# Altium schematic sheet pca20053_sheet4_power_supply.SchDoc: Thingy:53 Power Supply
size A3; Organization: Nordic Semiconductor; DocumentNumber: 4; SheetNumber: 4; SheetTotal: 6; CompanyName: Nordic Semiconductor; DocumentSize: A3
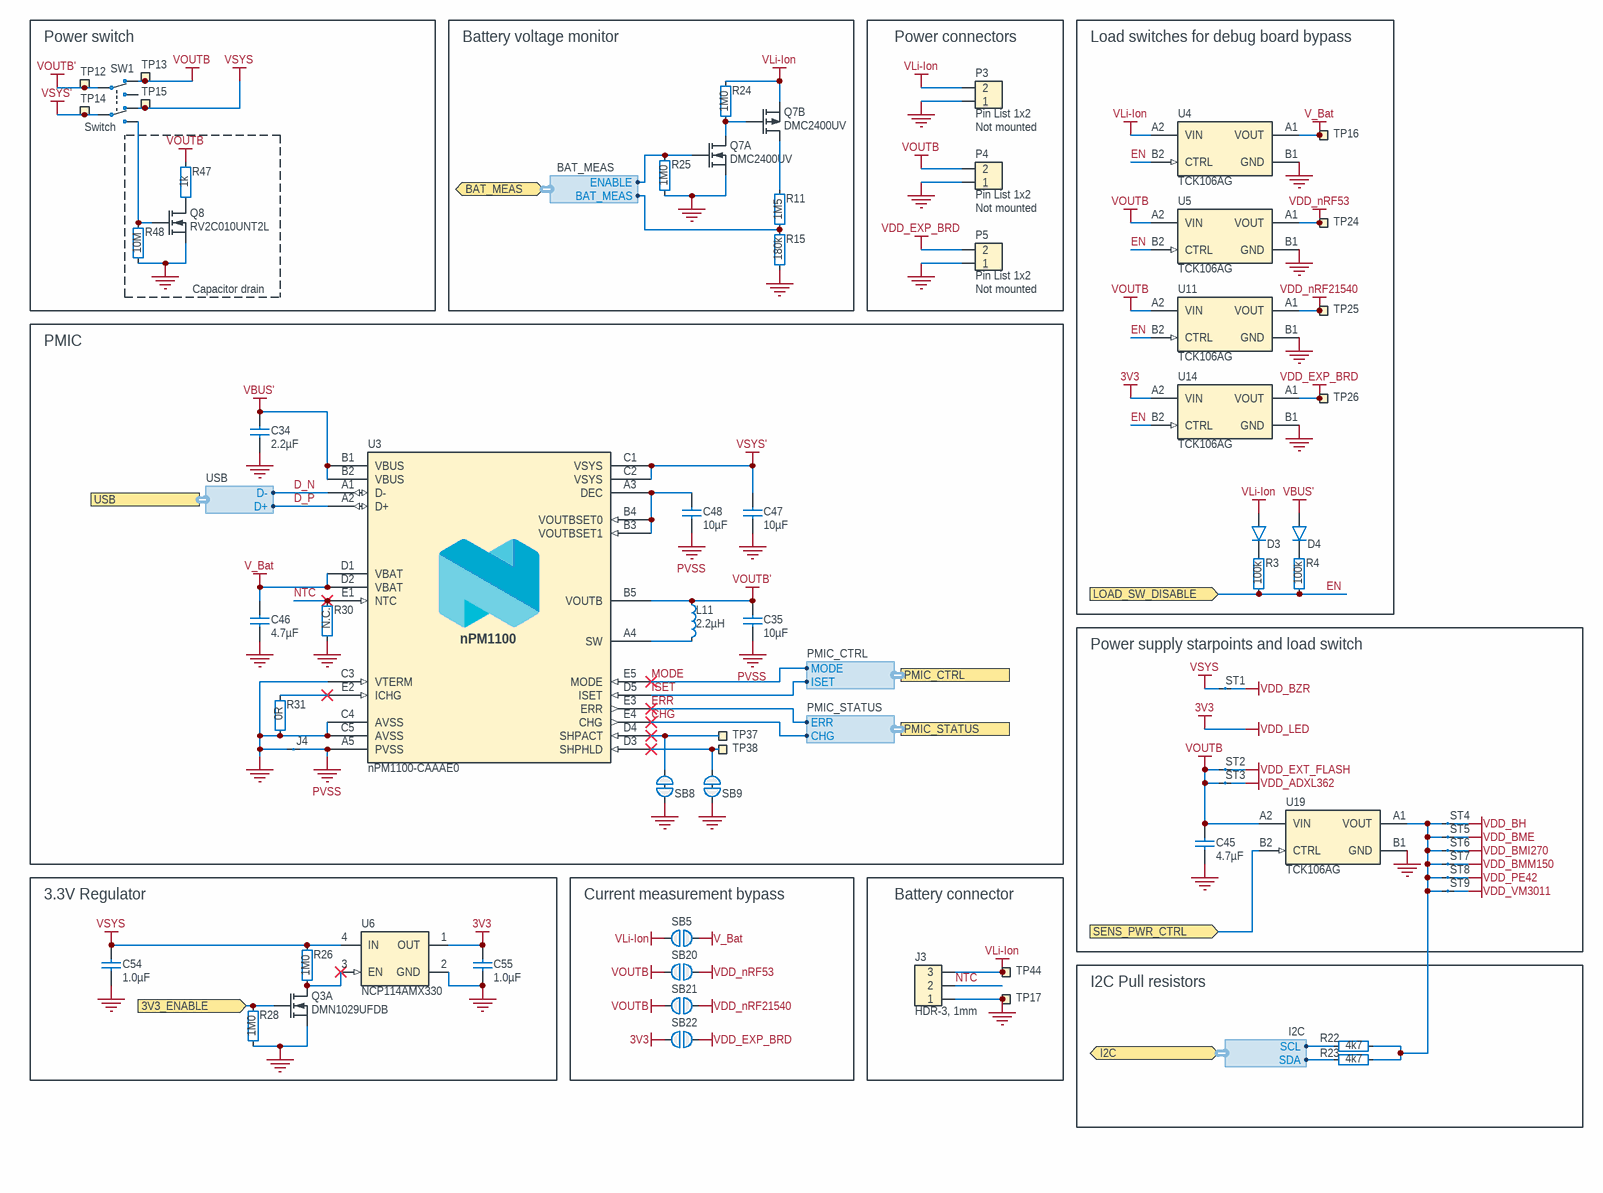
[diagram p0: pca20053_sheet4_power_supply.SchDoc]

## Parts
C34  2.2µF  [CAPC1608X06L]
C35  10µF  [CAPC1608X06L]
C45  4.7µF  [CAPC1608X06L]
C46  4.7µF  [CAPC1608X06L]
C47  10µF  [CAPC1608X06L]
C48  10µF  [CAPC1608X06L]
C54  1.0µF  [CAPC1005X04L]
C55  1.0µF  [CAPC1005X04L]
D3  BAS716  [SOD-523]  (value not drawn)
D4  BAS716  [SOD-523]  (value not drawn)
J3  HDR-3, 1mm  [SM03B-SRSS-TB]
J4  Net tie  [2 PIN STARPOINT]  (value not drawn)  (net tie, no BOM)
L11  2.2µH  [INDC1608X06L]
P3  Pin List 1x2  Assembly: Not mounted  [LIST_1x2-NC]
P4  Pin List 1x2  Assembly: Not mounted  [LIST_1x2-NC]
P5  Pin List 1x2  Assembly: Not mounted  [LIST_1x2-NC]
Q3  DMN1029UFDB  [DFN65P200X60_HS-6N]  (part A of 2)
Q7  DMC2400UV  [SOTFL50P162X60-6N]  (parts A,B of 2)
Q8  RV2C010UNT2L  [DFN65P100X40-3L]
R3  100k  [RESC0603X03L_C]
R4  100k  [RESC0603X03L_C]
R11  1M5  [RESC0603X03L_C]
R15  180k  [RESC0603X03L_C]
R22  4k7  [RESC0603X03L_C]
R23  4k7  [RESC0603X03L_C]
R24  1M0  [RESC0603X03L_C]
R25  1M0  [RESC0603X03L_C]
R26  1M0  [RESC0603X03L_C]
R28  1M0  [RESC0603X03L_C]
R30  N.C.  [RESC0603X03L_C_NC]
R31  0R  [RESC0603X03L_C]
R47  1k  [RESC0603X03L_C]
R48  10M  [RESC0603X03L_C]
SB5  Solderbridge  [Solderbridge]  (value not drawn)  (no BOM)
SB8  Solderbridge  [Solderbridge_Shorted]  (value not drawn)  (net tie, no BOM)
SB9  Solderbridge  [Solderbridge_Shorted]  (value not drawn)  (net tie, no BOM)
SB20  Solderbridge  [Solderbridge]  (value not drawn)  (no BOM)
SB21  Solderbridge  [Solderbridge]  (value not drawn)  (no BOM)
SB22  Solderbridge  [Solderbridge]  (value not drawn)  (no BOM)
ST1  Net tie  [2 PIN STARPOINT]  (value not drawn)  (net tie, no BOM)
ST2  Net tie  [2 PIN STARPOINT]  (value not drawn)  (net tie, no BOM)
ST3  Net tie  [2 PIN STARPOINT]  (value not drawn)  (net tie, no BOM)
ST4  Net tie  [2 PIN STARPOINT]  (value not drawn)  (net tie, no BOM)
ST5  Net tie  [2 PIN STARPOINT]  (value not drawn)  (net tie, no BOM)
ST6  Net tie  [2 PIN STARPOINT]  (value not drawn)  (net tie, no BOM)
ST7  Net tie  [2 PIN STARPOINT]  (value not drawn)  (net tie, no BOM)
ST8  Net tie  [2 PIN STARPOINT]  (value not drawn)  (net tie, no BOM)
ST9  Net tie  [2 PIN STARPOINT]  (value not drawn)  (net tie, no BOM)
SW1  Switch  [Switch-Slide-RA-J-Lead-DPDT-8.5x3.5mm]
TP12  Ø1.5mm,SMD  [TP_SMD_D1.5mm]  (value not drawn)  (no BOM)
TP13  Ø1.5mm,SMD  [TP_SMD_D1.5mm]  (value not drawn)  (no BOM)
TP14  Ø1.5mm,SMD  [TP_SMD_D1.5mm]  (value not drawn)  (no BOM)
TP15  Ø1.5mm,SMD  [TP_SMD_D1.5mm]  (value not drawn)  (no BOM)
TP16  Ø1.5mm,SMD  [TP_SMD_D1.5mm]  (value not drawn)  (no BOM)
TP17  Ø1.5mm,SMD  [TP_SMD_D1.5mm]  (value not drawn)  (no BOM)
TP24  Ø1.5mm,SMD  [TP_SMD_D1.5mm]  (value not drawn)  (no BOM)
TP25  Ø1.5mm,SMD  [TP_SMD_D1.5mm]  (value not drawn)  (no BOM)
TP26  Ø1.5mm,SMD  [TP_SMD_D1.5mm]  (value not drawn)  (no BOM)
TP37  Ø1.5mm,SMD  [TP_SMD_D1.5mm]  (value not drawn)  (no BOM)
TP38  Ø1.5mm,SMD  [TP_SMD_D1.5mm]  (value not drawn)  (no BOM)
TP44  Ø1.5mm,SMD  [TP_SMD_D1.5mm]  (value not drawn)  (no BOM)
U3  nPM1100-CAAAE0  [BGA25C40P5X5_200X200X50]
U4  TCK106AG  [BGA4C40P2X2_76X76X62]
U5  TCK106AG  [BGA4C40P2X2_76X76X62]
U6  NCP114AMX330  [UDFN65P100X100X60_HS-5N]
U11  TCK106AG  [BGA4C40P2X2_76X76X62]
U14  TCK106AG  [BGA4C40P2X2_76X76X62]
U19  TCK106AG  [BGA4C40P2X2_76X76X62]

## Blocks framed on the sheet
Power switch: SW1 TP12-TP15
Battery voltage monitor: Q7 R11 R15 R24 R25
Power connectors: P3-P5
Load switches for debug board bypass: D3 D4 R3 R4 TP16 TP24-TP26 U4 U5 U11 U14
Capacitor drain: Q8 R47 R48
PMIC: C34 C35 C46-C48 J4 L11 R30 R31 SB8 SB9 TP37 TP38 U3
Power supply starpoints and load switch: C45 ST1-ST9 U19
3.3V Regulator: C54 C55 Q3 R26 R28 U6
Current measurement bypass: SB5 SB20-SB22
Battery connector: J3 TP17 TP44
I2C Pull resistors: R22 R23

## Ports
3V3_ENABLE (in), BAT_MEAS (bidir, harness BAT_MEAS), I2C (bidir, harness I2C), LOAD_SW_DISABLE (in), PMIC_CTRL (harness PMIC_CTRL), PMIC_STATUS (harness PMIC_STATUS), SENS_PWR_CTRL (in), USB (harness USB)

## Harnesses
USB: D+, D-
PMIC_CTRL: ISET, MODE
PMIC_STATUS: ERR, CHG
BAT_MEAS: BAT_MEAS, ENABLE
I2C: SDA, SCL

## Nets
3V3: C55.1 SB22.2 U6.1(OUT) U14.A2(VIN)  [also labelled VDD_LED]
GND: C34.1 C45.1 C46.1 C47.1 C54.2 C55.2 J3.1 J4.1 P3.1 P4.1 P5.1 Q3.1(S1) Q7.1(S1) Q8.2(S) R15.1 R25.1 R28.1 R30.1 R31.1 R48.2 SB8.2 SB9.2 TP17.1 U3.C3(VTERM) U3.C4(AVSS) U3.C5(AVSS) U4.B1(GND) U5.B1(GND) U6.2(GND) U6.5(EPAD) U11.B1(GND) U14.B1(GND) U19.B1(GND)
PVSS: C35.1 C48.1 J4.2 U3.A5(PVSS)
V_Bat: C46.2 SB5.1 TP16.1 U3.D1(VBAT) U3.D2(VBAT) U4.A1(VOUT)
VBUS': C34.2 D4.1(A) U3.B1(VBUS) U3.B2(VBUS)
VDD_ADXL362: ST3.2
VDD_BH: ST4.2
VDD_BME: ST5.2
VDD_BMI270: ST6.2
VDD_BMM150: ST7.2
VDD_BZR: ST1.2
VDD_EXP_BRD: P5.2 SB22.1 TP26.1 U14.A1(VOUT)
VDD_EXT_FLASH: ST2.2
VDD_nRF53: SB20.1 TP24.1 U5.A1(VOUT)
VDD_nRF21540: SB21.1 TP25.1 U11.A1(VOUT)
VDD_PE42: ST8.2
VDD_VM3011: ST9.2
VLi-Ion: D3.1(A) J3.3 P3.2 Q7.4(S2) R24.1 SB5.2 TP44.1 U4.A2(VIN)
VOUTB: C45.2 P4.2 R47.1 SB20.2 SB21.2 ST2.1 ST3.1 SW1.3(N.C-1) TP13.1 U5.A2(VIN) U11.A2(VIN) U19.A2(VIN)
VOUTB': C35.2 L11.1 SW1.2(COM-1) TP12.1 U3.B5(VOUTB)
VSYS: C54.1 R26.2 ST1.1 SW1.6(N.C-2) TP15.1 U6.4(IN)
VSYS': C47.2 SW1.5(COM-2) TP14.1 U3.C1(VSYS) U3.C2(VSYS)
3V3_ENABLE: Q3.2(G1) R28.2 ; port 3V3_ENABLE
CHG: U3.E4(CHG) ; port PMIC_STATUS.CHG
D_N: U3.A1(D-) ; port USB.D-
D_P: U3.A2(D+) ; port USB.D+
EN: R3.1 R4.1 U4.B2(CTRL) U5.B2(CTRL) U11.B2(CTRL) U14.B2(CTRL) ; port LOAD_SW_DISABLE
ERR: U3.E3(ERR) ; port PMIC_STATUS.ERR
ISET: U3.D5(ISET) ; port PMIC_CTRL.ISET
MODE: U3.E5(MODE) ; port PMIC_CTRL.MODE
NTC: J3.2 R30.2 U3.E1(NTC)
SENS_PWR_CTRL: U19.B2(CTRL) ; port SENS_PWR_CTRL
NetC48_2: C48.2 U3.A3(DEC) U3.B3(VOUTBSET1) U3.B4(VOUTBSET0)
NetD3_3: D3.3(C) R3.2
NetD4_3: D4.3(C) R4.2
NetL11_2: L11.2 U3.A4(SW)
NetQ3_6: Q3.6(D1) R26.1 U6.3(EN)
NetQ7_2: Q7.2(G1) R25.2 ; port BAT_MEAS.ENABLE
NetQ7_3: Q7.3(D2) R11.2
NetQ7_5: Q7.5(G2) Q7.6(D1) R24.2
NetQ8_1: Q8.1(G) R48.1 SW1.4(N.O-2)
NetQ8_3: Q8.3(D) R47.2
NetR11_1: R11.1 R15.2 ; port BAT_MEAS.BAT_MEAS
NetR22_1: R22.1 R23.1 ST4.1 ST5.1 ST6.1 ST7.1 ST8.1 ST9.1 U19.A1(VOUT)
NetR22_2: R22.2 ; port I2C.SCL
NetR23_2: R23.2 ; port I2C.SDA
NetR31_2: R31.2 U3.E2(ICHG)
NetSB8_1: SB8.1 TP37.1 U3.D4(SHPACT)
NetSB9_1: SB9.1 TP38.1 U3.D3(SHPHLD)

Not connected (* = marked no-connect by the designer): SW1 1(N.O-1)

## Notes on the sheet
- Title
- Size
- Date:
- File:
- A3
- PCB Assembly Number
- Sheet         of
- Drawn By:
- Revision
- Classification:
- (in symbol nPM1100-CAAAE0) nPM1100

## Library data of the parts
C34 = C0603-2µ2-25V-X5R-GRM188R61E225KA12D: Capacitor, Ceramic, X5R, ±10%, 25V; Manufacturer: Murata; Part number NEMS: 100200454; Artikkelnr Noca: N.A.; Pad Count: 2; Component Status: Active; Part Number: C0603-2µ2-25V-X5R-GRM188R61E225KA12D; Manufacturer Part Number: GRM188R61E225KA12D; ComponentLink1URL: https://search.murata.co.jp/Ceramy/image/img/A01X/G101/ENG/GRM188R61E225KA12-01.pdf; ComponentLink1Description: Datasheet; ComponentLink2URL: https://www.murata.com/en-global/products/productdetail?partno=GRM188R61E225KA12%23; ComponentLink2Description: Supplier link; HelpURL: N.A.; Footprint Doc: 0603; LatestRevisionDate: 2021-07-22; Published: 2020-12-16; Value: 2.2µF; Note: 25V; Supplier 1: Digi-Key; Supplier Part Number 1: 490-10731-1-ND; Supplier 2: Mouser; Supplier Part Number 2: 81-GRM188R61E225KA2D; Part number IPS: N.A.; Component Class: Capacitors; PartId: 100200454; Author: rsk; Part number Norautron: N.A.
C35 C47 C48 = C0603-10µ-25V-X5R-GRM188R61E106MA73J: Capacitor, Ceramic, X5R, ±20%, 25V; Manufacturer: Murata; Part number NEMS: 100200456; Artikkelnr Noca: N.A.; Pad Count: 2; Component Status: Active; Part Number: C0603-10µ-25V-X5R-GRM188R61E106MA73J; Manufacturer Part Number: GRM188R61E106MA73J; ComponentLink1URL: https://search.murata.co.jp/Ceramy/image/img/A01X/G101/ENG/GRM188R61E106MA73-01.pdf; ComponentLink1Description: Datasheet; ComponentLink2URL: https://www.murata.com/en-global/products/productdetail?partno=GRM188R61E106MA73%23; ComponentLink2Description: Supplier link; HelpURL: N.A.; Footprint Doc: 0603; LatestRevisionDate: 2021-07-22; Published: 2020-12-16; Value: 10µF; Note: 25V; Supplier 1: Digi-Key; Supplier Part Number 1: 490-12737-1-ND; Supplier 2: Mouser; Supplier Part Number 2: 81-GRM188R61E106MA3J; Part number IPS: N.A.; Component Class: Capacitors; PartId: 100200456; Author: rsk; Part number Norautron: N.A.
C45 C46 = C0603-4µ7-25V-X5R: Capacitor, X5R, ±10%, 25V; Manufacturer: Murata; Manufacturer Part Number: GRM188R61E475KE11D; Part number NEMS: 100200352; Artikkelnr Noca: N.A.; Pad Count: 2; Component Status: Active; Part Number: C0603-4µ7-25V-X5R; Footprint Doc: 0603; LatestRevisionDate: 2019-06-11; Published: 2019-06-11; Value: 4.7µF; Note: 25V; Part number IPS: N.A.; ComponentLink1URL: https://www.murata.com/~/media/webrenewal/support/library/catalog/products/capacitor/mlcc/c02e.ashx?la=en-us; ComponentLink1Description: Datasheet; ComponentLink2URL: https://www.digikey.com/product-detail/en/murata-electronics-north-america/GRM188R61E475KE11D/490-7203-1-ND/3900450; ComponentLink2Description: Supplier link; HelpURL: https://www.murata.com/~/media/webrenewal/support/library/catalog/products/capacitor/mlcc/c02e.ashx?la=en-us; Supplier 1: Digi-Key; Supplier Part Number 1: 490-7203-1-ND; Supplier 2: N.A.; Supplier Part Number 2: N.A.; Component Class: Capacitors; PartId: 100200352; Author: rsk; Part number Norautron: N.A.
C54 C55 = C0402-1µ0-25V-X5R: Capacitor, Ceramic, X5R, ±10%, 25V; Manufacturer: Murata; Manufacturer Part Number: GRM155R61E105KA12D; Part number NEMS: 100200453; Artikkelnr Noca: N.A.; Pad Count: 2; Component Status: Active; Part Number: C0402-1µ0-25V-X5R; ComponentLink1URL: https://search.murata.co.jp/Ceramy/image/img/A01X/G101/ENG/GRM155R61E105KA12-01.pdf; ComponentLink1Description: Datasheet; ComponentLink2URL: https://www.murata.com/en-global/products/productdetail?partno=GRM155R61E105KA12%23; ComponentLink2Description: Supplier link; HelpURL: N.A.; Footprint Doc: 0402; LatestRevisionDate: 2020-12-16; Published: 2020-12-16; Value: 1.0µF; Note: 25V; Part number IPS: N.A.; Supplier 1: Digi-Key; Supplier Part Number 1: 490-10017-1-ND; Supplier 2: Mouser; Supplier Part Number 2: 81-GRM155R61E105KA2D; Component Class: Capacitors; PartId: 100200453; Author: rsk; Part number Norautron: N.A.
D3 D4 = BAS716: Low-leakage diode, Diode gen. purpose, Vf=1.25 V @ 150 mA, Ir=5.0 nA @ 75 V, If=200 mA; Manufacturer: Nexperia; Part number NEMS: 101300193; Pad Count: 2; Note: N.A.; Component Status: Active; Part Number: BAS716; PartId: 101300193; Component Class: Semiconductors; Manufacturer Part Number: BAS716; ComponentLink1URL: https://assets.nexperia.com/documents/data-sheet/BAS716.pdf; ComponentLink1Description: Datasheet; ComponentLink2URL: https://www.digikey.com/en/products/detail/nexperia-usa-inc/BAS716-115/1232107; ComponentLink2Description: Supplier link; HelpURL: https://www.nexperia.com/products/diodes/automotive-diodes/automotive-switching-diodes/automotive-low-leakage-current-switching-diodes/BAS716.html; Footprint Doc: SOD-523; LatestRevisionDate: 2022-08-23; Published: 2022-08-23; Value: BAS716; Supplier 1: Digi-Key; Supplier Part Number 1: 1727-4813-1-ND; Supplier 2: Mouser; Supplier Part Number 2: 771-BAS716-T/R; Artikkelnr Noca: N.A.; Part number IPS: N.A.; Author: rubr; Part number Norautron: N.A.
J3 = SM03B-SRSS-TB: 1.0mm pitch connector side entry SMD; Manufacturer: JST Sales America Inc.; Manufacturer Part Number: SM03B-SRSS-TB(LF)(SN); Part number IPS: 00000001785; Part number Norautron: 26032360; Part number NEMS: 100500605; Note: JST, Header; Artikkelnr Noca: N.A.; Pad Count: 3; Component Status: Active; Part Number: SM03B-SRSS-TB; Footprint Doc: SM03B-SRSS-TB; LatestRevisionDate: 2017-10-09; Published: 2017-10-09; Value: HDR-3, 1mm; ComponentLink1URL: N.A.; ComponentLink1Description: Datasheet; ComponentLink2URL: N.A.; ComponentLink2Description: Supplier link; HelpURL: http://www.jst-mfg.com/product/pdf/eng/eSH.pdf; Supplier 1: Cabcon; Supplier Part Number 1: SM03B-SRSS-TB(LF)(SN); Supplier 2: Digi-Key; Supplier Part Number 2: 455-1803-1-ND; Component Class: Connectors; PartId: 100500605; Author: rsk; System: Connector
J4 ST1-ST9 = 2 pin starpoint: Starpoint; Manufacturer: N.A.; Part number NEMS: 100500603; Pad Count: 2; Component Status: Active; System: Connector; Part Number: 2 pin starpoint; Manufacturer Part Number: N.A.; ComponentLink1URL: N.A.; ComponentLink1Description: Datasheet; ComponentLink2URL: N.A.; ComponentLink2Description: Supplier link; HelpURL: N.A.; Footprint Doc: N.A.; LatestRevisionDate: 2017-08-31; Published: 2017-08-31; Value: Net tie; Note: Net tie; Supplier 1: N.A.; Supplier Part Number 1: N.A.; Supplier 2: N.A.; Supplier Part Number 2: N.A.; Artikkelnr Noca: N.A.; Part number IPS: N.A.; Component Class: Connectors; PartId: 100500603; Author: rsk; Part number Norautron: N.A.
L11 = L0603-2µ2-TY: Inductor, 520mA, ±20%, 300mOhm; Manufacturer: Taiyo Yuden; Manufacturer Part Number: MBKK1608T2R2M; Part number NEMS: 100300404; Note: -40°C ~ 105°C; Artikkelnr Noca: N.A.; Pad Count: 2; Component Status: Active; Part Number: L0603-2µ2-TY; ComponentLink1URL: https://ds.yuden.co.jp/TYCOMPAS/ut/specSheet?pn=MBKK1608T2R2M++; ComponentLink1Description: Datasheet; ComponentLink2URL: https://www.digikey.com/en/products/detail/taiyo-yuden/MBKK1608T2R2M/5035129; ComponentLink2Description: Supplier link; HelpURL: https://ds.yuden.co.jp/TYCOMPAS/ut/detail?pn=MBKK1608T2R2M&u=M; Footprint Doc: 0603; LatestRevisionDate: 2021-04-27; Published: 2021-04-27; Value: 2.2µH; Supplier 1: Digi-Key; Supplier Part Number 1: 587-4150-1-ND; Supplier 2: N.A.; Supplier Part Number 2: N.A.; Part number IPS: N.A.; Component Class: Inductors; Author: rubr; Part number Norautron: N.A.; PartId: 100300404
P3-P5 = Pin List 1x2, N.C.: Pin List 1x2, 2.54mm (100mil); Manufacturer: N.A.; Part number NEMS: 100500298; Pad Count: 2; Component Status: Active; System: Connector; Part Number: Pin List 1x2, N.C.; Manufacturer Part Number: N.A.; Footprint Doc: LIST_1x2; LatestRevisionDate: 2017-02-02; Published: 2017-01-30; Value: Pin List 1x2; Note: N.A.; Artikkelnr Noca: N.A.; Part number IPS: N.A.; ComponentLink1URL: N.A.; ComponentLink1Description: Datasheet; ComponentLink2URL: N.A.; ComponentLink2Description: Supplier link; HelpURL: N.A.; Supplier 1: N.A.; Supplier Part Number 1: N.A.; Supplier 2: N.A.; Supplier Part Number 2: N.A.; Component Class: Connectors; PartId: 100500298; Author: rsk; Part number Norautron: N.A.
Q3 = DMN1029UFDB: Dual N Ch MOFET, 5.6A, 29mOhm @ 5A, 4.5V, 1.4W; Manufacturer: Diodes Incorporated; Manufacturer Part Number: DMN1029UFDB-7; Part number NEMS: 101300175; Note: N.A.; Pad Count: 6; Component Status: Active; Part Number: DMN1029UFDB; Footprint Doc: DFN-6; LatestRevisionDate: 2020-04-29; Published: 2020-04-29; Value: DMN1029UFDB; Artikkelnr Noca: N.A.; Part number IPS: N.A.; Supplier 1: Digi-Key; Supplier Part Number 1: DMN1029UFDB-7DICT-ND; Supplier 2: Mouser; Supplier Part Number 2: 621-DMN1029UFDB-7; ComponentLink1URL: https://www.diodes.com/assets/Datasheets/DMN1029UFDB.pdf; ComponentLink1Description: Datasheet; ComponentLink2URL: N.A.; ComponentLink2Description: Supplier link; HelpURL: https://www.diodes.com/assets/Datasheets/DMN1029UFDB.pdf; Component Class: Semiconductors; PartId: 101300175; Author: rsk; Part number Norautron: N.A.
Q7 = DMC2400UV: Dual N & P Ch MOFET, 1.03A/0.7A, 480mOhm, 450mW; Manufacturer: Diodes Incorporated; Part number IPS: 00000007803; Part number NEMS: 101300117; Pad Count: 6; Note: Dual N & P Channel Digital FET; Artikkelnr Noca: N.A.; Component Status: Active; Part Number: DMC2400UV; PartId: 101300117; Component Class: Semiconductors; Manufacturer Part Number: DMC2400UV; ComponentLink1URL: N.A.; ComponentLink1Description: Datasheet; ComponentLink2URL: N.A.; ComponentLink2Description: Supplier link; HelpURL: http://www.diodes.com/_files/datasheets/DMC2400UV.pdf; Footprint Doc: SOT-563; LatestRevisionDate: 2016-01-18; Published: 2016-01-18; Value: DMC2400UV; Supplier 1: Digi-Key; Supplier Part Number 1: DMC2400UV-7DICT-ND; Supplier 2: N.A.; Supplier Part Number 2: N.A.; Author: rsk; Part number Norautron: N.A.
Q8 = RV2C010UNT2L: N-Channel MOSFET, 20V, 1A, 470mOhm, 400mW; Manufacturer: Rohm Semiconductor; Part number IPS: 00000009976; Part number Norautron: 26320026; Part number NEMS: 101300132; Note: N.A.; Artikkelnr Noca: 35010020; Pad Count: 3; Component Status: Active; Part Number: RV2C010UNT2L; Manufacturer Part Number: RV2C010UNT2L; Footprint Doc: DFN-3; LatestRevisionDate: 2016-08-09; Published: 2016-08-09; Value: RV2C010UNT2L; ComponentLink1URL: N.A.; ComponentLink1Description: Datasheet; ComponentLink2URL: N.A.; ComponentLink2Description: Supplier link; HelpURL: http://rohmfs.rohm.com/en/products/databook/datasheet/discrete/transistor/mosfet/rv2c010unt2l-e.pdf; Supplier 1: Digi-Key; Supplier Part Number 1: RV2C010UNT2LCT-ND; Supplier 2: Mouser; Supplier Part Number 2: 755-RV2C010UNT2L; Component Class: Semiconductors; PartId: 101300132; Author: rsk
R3 R4 = R0201-100k: Resistor, ±1%, 0.05W; Manufacturer: N.A.; Part number IPS: 00000001419; Part number Norautron: 26108487; Part number NEMS: 100100080; Note: Chip Res 1%; Pad Count: 2; Component Status: Active; Part Number: R0201-100k; Manufacturer Part Number: N.A.; ComponentLink1URL: N.A.; ComponentLink1Description: Datasheet; ComponentLink2URL: N.A.; ComponentLink2Description: Supplier link; HelpURL: N.A.; Footprint Doc: 0201; LatestRevisionDate: 2014-11-13; Published: 2014-11-13; Value: 100k; Supplier 1: N.A.; Supplier Part Number 1: N.A.; Supplier 2: N.A.; Supplier Part Number 2: N.A.; Artikkelnr Noca: N.A.; Component Class: Resistors; PartId: 100100080; Author: rsk
R11 = R0201-1M5: Resistor, ±1%, 0.05W; Manufacturer: N.A.; Part number NEMS: 100100095; Pad Count: 2; Note: Chip Res 1%; Component Status: Active; Part Number: R0201-1M5; PartId: 100100095; Component Class: Resistors; Manufacturer Part Number: N.A.; ComponentLink1URL: N.A.; ComponentLink1Description: Datasheet; ComponentLink2URL: N.A.; ComponentLink2Description: Supplier link; HelpURL: N.A.; Footprint Doc: 0201; LatestRevisionDate: 2014-11-13; Published: 2014-11-13; Value: 1M5; Supplier 1: N.A.; Supplier Part Number 1: N.A.; Supplier 2: N.A.; Supplier Part Number 2: N.A.; Artikkelnr Noca: N.A.; Part number IPS: N.A.; Author: rsk; Part number Norautron: N.A.
R15 = R0201-180k: Resistor, ±1%, 0.05W; Manufacturer: N.A.; Part number IPS: 00000004797; Part number NEMS: 100100083; Pad Count: 2; Note: Chip Res 1%; Component Status: Active; Part Number: R0201-180k; PartId: 100100083; Component Class: Resistors; Manufacturer Part Number: N.A.; ComponentLink1URL: N.A.; ComponentLink1Description: Datasheet; ComponentLink2URL: N.A.; ComponentLink2Description: Supplier link; HelpURL: N.A.; Footprint Doc: 0201; LatestRevisionDate: 2014-11-13; Published: 2014-11-13; Value: 180k; Supplier 1: N.A.; Supplier Part Number 1: N.A.; Supplier 2: N.A.; Supplier Part Number 2: N.A.; Artikkelnr Noca: N.A.; Author: rsk; Part number Norautron: N.A.
R22 R23 = R0201-4k7: Resistor, ±1%, 0.05W; Manufacturer: N.A.; Part number IPS: 00000001706; Part number NEMS: 100100061; Note: Chip Res 1%; Pad Count: 2; Component Status: Active; Part Number: R0201-4k7; Manufacturer Part Number: N.A.; Footprint Doc: 0201; LatestRevisionDate: 2014-11-13; Published: 2014-11-13; Value: 4k7; Artikkelnr Noca: N.A.; ComponentLink1URL: N.A.; ComponentLink1Description: Datasheet; ComponentLink2URL: N.A.; ComponentLink2Description: Supplier link; HelpURL: N.A.; Supplier 1: N.A.; Supplier Part Number 1: N.A.; Supplier 2: N.A.; Supplier Part Number 2: N.A.; Component Class: Resistors; PartId: 100100061; Author: rsk; Part number Norautron: N.A.
R24-R26 R28 = R0201-1M0: Resistor, ±1%, 0.05W; Manufacturer: N.A.; Part number IPS: 00000001418; Part number Norautron: 26107108; Part number NEMS: 100100093; Pad Count: 2; Note: Chip Res 1%; Component Status: Active; Part Number: R0201-1M0; PartId: 100100093; Component Class: Resistors; Manufacturer Part Number: N.A.; ComponentLink1URL: N.A.; ComponentLink1Description: Datasheet; ComponentLink2URL: N.A.; ComponentLink2Description: Supplier link; HelpURL: N.A.; Footprint Doc: 0201; LatestRevisionDate: 2014-11-13; Published: 2014-11-13; Value: 1M0; Supplier 1: N.A.; Supplier Part Number 1: N.A.; Supplier 2: N.A.; Supplier Part Number 2: N.A.; Artikkelnr Noca: N.A.; Author: rsk
R30 = R0201-N.C.: Not mounted; Manufacturer: N.A.; Part number NEMS: 100100107; Assembly: Not mounted; Note: Chip Res; Pad Count: 2; Component Status: Active; Part Number: R0201-N.C.; Manufacturer Part Number: N.A.; ComponentLink1URL: N.A.; ComponentLink1Description: Datasheet; ComponentLink2URL: N.A.; ComponentLink2Description: Supplier link; HelpURL: N.A.; Footprint Doc: 0201; LatestRevisionDate: 2014-11-13; Published: 2014-11-13; Value: N.C.; Supplier 1: N.A.; Supplier Part Number 1: N.A.; Supplier 2: N.A.; Supplier Part Number 2: N.A.; Artikkelnr Noca: N.A.; Part number IPS: N.A.; Component Class: Resistors; PartId: 100100107; Author: rsk; Part number Norautron: N.A.
R31 = R0201-0R: Resistor, ±5%, 0.05W; Manufacturer: N.A.; Part number IPS: 00000003245; Part number NEMS: 100100001; Note: Chip Res 5%; Pad Count: 2; Component Status: Active; Part Number: R0201-0R; Manufacturer Part Number: N.A.; ComponentLink1URL: N.A.; ComponentLink1Description: Datasheet; ComponentLink2URL: N.A.; ComponentLink2Description: Supplier link; HelpURL: N.A.; Footprint Doc: 0201; LatestRevisionDate: 2017-11-09; Published: 2014-11-13; Value: 0R; Supplier 1: N.A.; Supplier Part Number 1: N.A.; Supplier 2: N.A.; Supplier Part Number 2: N.A.; Artikkelnr Noca: N.A.; Component Class: Resistors; PartId: 100100001; Author: rsk; Part number Norautron: N.A.
R47 = R0201-1k0: Resistor, ±1%, 0.05W; Manufacturer: N.A.; Part number IPS: 00000005786; Part number NEMS: 100100043; Note: Chip Res 1%; Pad Count: 2; Component Status: Active; Part Number: R0201-1k0; Manufacturer Part Number: N.A.; LatestRevisionDate: 2014-11-13; Published: 2014-11-13; Value: 1k; Artikkelnr Noca: N.A.; Footprint Doc: 0201; ComponentLink1URL: N.A.; ComponentLink1Description: Datasheet; ComponentLink2URL: N.A.; ComponentLink2Description: Supplier link; HelpURL: N.A.; Supplier 1: N.A.; Supplier Part Number 1: N.A.; Supplier 2: N.A.; Supplier Part Number 2: N.A.; Component Class: Resistors; PartId: 100100043; Author: rsk; Part number Norautron: N.A.
R48 = R0201-10M: Resistor, ±1%, 0.05W; Manufacturer: N.A.; Part number IPS: 00000001426; Part number NEMS: 100100105; Note: Chip Res 1%; Pad Count: 2; Component Status: Active; Part Number: R0201-10M; Manufacturer Part Number: N.A.; LatestRevisionDate: 2014-11-13; Published: 2014-11-13; Value: 10M; Artikkelnr Noca: N.A.; Footprint Doc: 0201; ComponentLink1URL: N.A.; ComponentLink1Description: Datasheet; ComponentLink2URL: N.A.; ComponentLink2Description: Supplier link; HelpURL: N.A.; Supplier 1: N.A.; Supplier Part Number 1: N.A.; Supplier 2: N.A.; Supplier Part Number 2: N.A.; Component Class: Resistors; PartId: 100100105; Author: rsk; Part number Norautron: N.A.
SB5 SB20-SB22 = Solderbridge: Manufacturer: N.A.; Part number NEMS: 100500458; Pad Count: 2; Component Status: Active; System: Connector; Part Number: Solderbridge; Manufacturer Part Number: N.A.; ComponentLink1URL: N.A.; ComponentLink1Description: Datasheet; ComponentLink2URL: N.A.; ComponentLink2Description: Supplier link; HelpURL: N.A.; Footprint Doc: Solderbridge; LatestRevisionDate: 2009-12-14; Published: 2009-12-14; Value: Solderbridge; Note: N.A.; Supplier 1: N.A.; Supplier Part Number 1: N.A.; Supplier 2: N.A.; Supplier Part Number 2: N.A.; Artikkelnr Noca: N.A.; Part number IPS: N.A.; Component Class: Connectors; PartId: 100500458; Author: rsk; Part number Norautron: N.A.
SB8 SB9 = Solderbridge Shorted: Shorted Solderbridge; Manufacturer: N.A.; Part number NEMS: 100500459; Pad Count: 2; Component Status: Active; System: Connector; Part Number: Solderbridge Shorted; PartId: 100500459; Component Class: Connectors; Author: rsk; Manufacturer Part Number: N.A.; ComponentLink1URL: N.A.; ComponentLink1Description: Datasheet; ComponentLink2URL: N.A.; ComponentLink2Description: Supplier link; HelpURL: N.A.; Footprint Doc: Solderbridge_Shorted; LatestRevisionDate: 2012-08-07; Published: 2012-08-07; Value: Solderbridge; Note: N.A.; Supplier 1: N.A.; Supplier Part Number 1: N.A.; Supplier 2: N.A.; Supplier Part Number 2: N.A.; Artikkelnr Noca: N.A.; Part number IPS: N.A.; Part number Norautron: N.A.
SW1 = Switch-Slide-RA-J-Lead-DPDT-8.5x3.5mm_Copal: SMD slide Switch (ON-ON); Manufacturer: Copal Electronics Inc; Manufacturer Part Number: CL-SB-22A-11T; Part number IPS: 00000007811; Part number Norautron: 26470017; Part number NEMS: 101500038; Note: N.A.; Pad Count: 6; Component Status: Active; Part Number: Switch-Slide-RA-J-Lead-DPDT-8.5x3.5mm_Copal; Footprint Doc: Switch-Slide-RA-J-Lead-DPDT-8.5x3.5mm; LatestRevisionDate: 2017-02-01; Published: 2017-02-01; Value: Switch; Artikkelnr Noca: N.A.; ComponentLink1URL: N.A.; ComponentLink1Description: Datasheet; ComponentLink2URL: N.A.; ComponentLink2Description: Supplier link; HelpURL: http://www.nidec-copal-electronics.com/e/catalog/switch/cl-sb.pdf; Supplier 1: Digi-Key; Supplier Part Number 1: 563-1340-1-ND; Supplier 2: Avnet; Supplier Part Number 2: CL-SB-22A-11T; Component Class: Switches; PartId: 101500038; Author: rsk
TP12-TP17 TP24-TP26 TP37 TP38 TP44 = TP_SMD_Ø1.5MM: 1.5mm circular SMD testpad; Manufacturer: Nordic Semiconductor; Manufacturer Part Number: N.A.; Part number NEMS: 100500477; Pad Count: 1; Component Status: Active; System: Connector; Part Number: TP_SMD_Ø1.5MM; Footprint Doc: TP_SMD_Ø1.5mm; LatestRevisionDate: 2021-03-05; Published: 2016-06-02; Value: Ø1.5mm,SMD; Note: N.A.; Artikkelnr Noca: N.A.; Part number IPS: N.A.; ComponentLink1URL: N.A.; ComponentLink1Description: Datasheet; ComponentLink2URL: N.A.; ComponentLink2Description: Supplier link; HelpURL: N.A.; Supplier 1: N.A.; Supplier Part Number 1: N.A.; Supplier 2: N.A.; Supplier Part Number 2: N.A.; Component Class: Connectors; PartId: 100500477; Author: rsk; Part number Norautron: N.A.
U3 = nPM1100-CAAAE0: Li-Ion/Li-Polymer USB battery charger with a high efficiency buck regulator; Manufacturer: Nordic Semiconductor; Part number NEMS: 102000247; Note: N.A.; Pad Count: 25; Component Status: Active; Part Number: nPM1100-CAAAE0; Manufacturer Part Number: nPM1100-CAAAE0; LatestRevisionDate: 2022-01-25; Published: 2022-01-25; Value: nPM1100-CAAAE0; Footprint Doc: WLCSP-25; ComponentLink1URL: N.A.; ComponentLink1Description: Datasheet; ComponentLink2URL: N.A.; ComponentLink2Description: Supplier link; HelpURL: N.A.; Supplier 1: Nordic Semiconductor; Supplier Part Number 1: N.A.; Supplier 2: N.A.; Supplier Part Number 2: N.A.; Artikkelnr Noca: N.A.; Part number IPS: N.A.; Component Class: nRF_Devices; Author: rubr; Part number Norautron: N.A.; PartId: 102000247
U4 U5 U11 U14 U19 = TCK106AG: 1.0 A Load Switch IC with Slew Rate Control Driver in Ultra Small Package; Manufacturer: Toshiba; Manufacturer Part Number: TCK106AG,LF; Part number IPS: 00000004390; Part number Norautron: 26500627; Part number NEMS: 101900575; Note: N.A.; Pad Count: 4; Component Status: Active; Part Number: TCK106AG; ComponentLink1URL: https://toshiba.semicon-storage.com/info/docget.jsp?did=30131&prodName=TCK106AG; ComponentLink1Description: Datasheet; ComponentLink2URL: N.A.; ComponentLink2Description: Supplier link; HelpURL: N.A.; Footprint Doc: WLCSP-4; LatestRevisionDate: 2019-03-01; Published: 2019-02-17; Value: TCK106AG; Supplier 1: Digi-Key; Supplier Part Number 1: TCK106AGLFTR-ND; Supplier 2: Mouser; Supplier Part Number 2: 757-TCK106AGLF; Artikkelnr Noca: N.A.; Component Class: Misc_ICs; PartId: 101900575; Author: rsk
U6 = NCP114AMX330TBG: 300 mA CMOS Low Dropout Regulator; Manufacturer: ON Semiconductor; Part number NEMS: 101900525; Note: N.A.; Pad Count: 4; Component Status: Active; Part Number: NCP114AMX330TBG; Manufacturer Part Number: NCP114AMX330TBG; ComponentLink1URL: http://www.onsemi.com/pub/Collateral/NCP114-D.PDF; ComponentLink1Description: Datasheet; ComponentLink2URL: N.A.; ComponentLink2Description: Supplier link; HelpURL: N.A.; Footprint Doc: UDFN-4; LatestRevisionDate: 2018-04-10; Published: 2018-04-10; Value: NCP114AMX330; Artikkelnr Noca: N.A.; Part number IPS: N.A.; Supplier 1: Digi-Key; Supplier Part Number 1: NCP114AMX330TBGOSCT-ND; Supplier 2: N.A.; Supplier Part Number 2: N.A.; Component Class: Misc_ICs; PartId: 101900525; Author: rsk; Part number Norautron: N.A.